# EAGLE design PIC 16F877A Board_V2 (EAGLE 9.6.2)
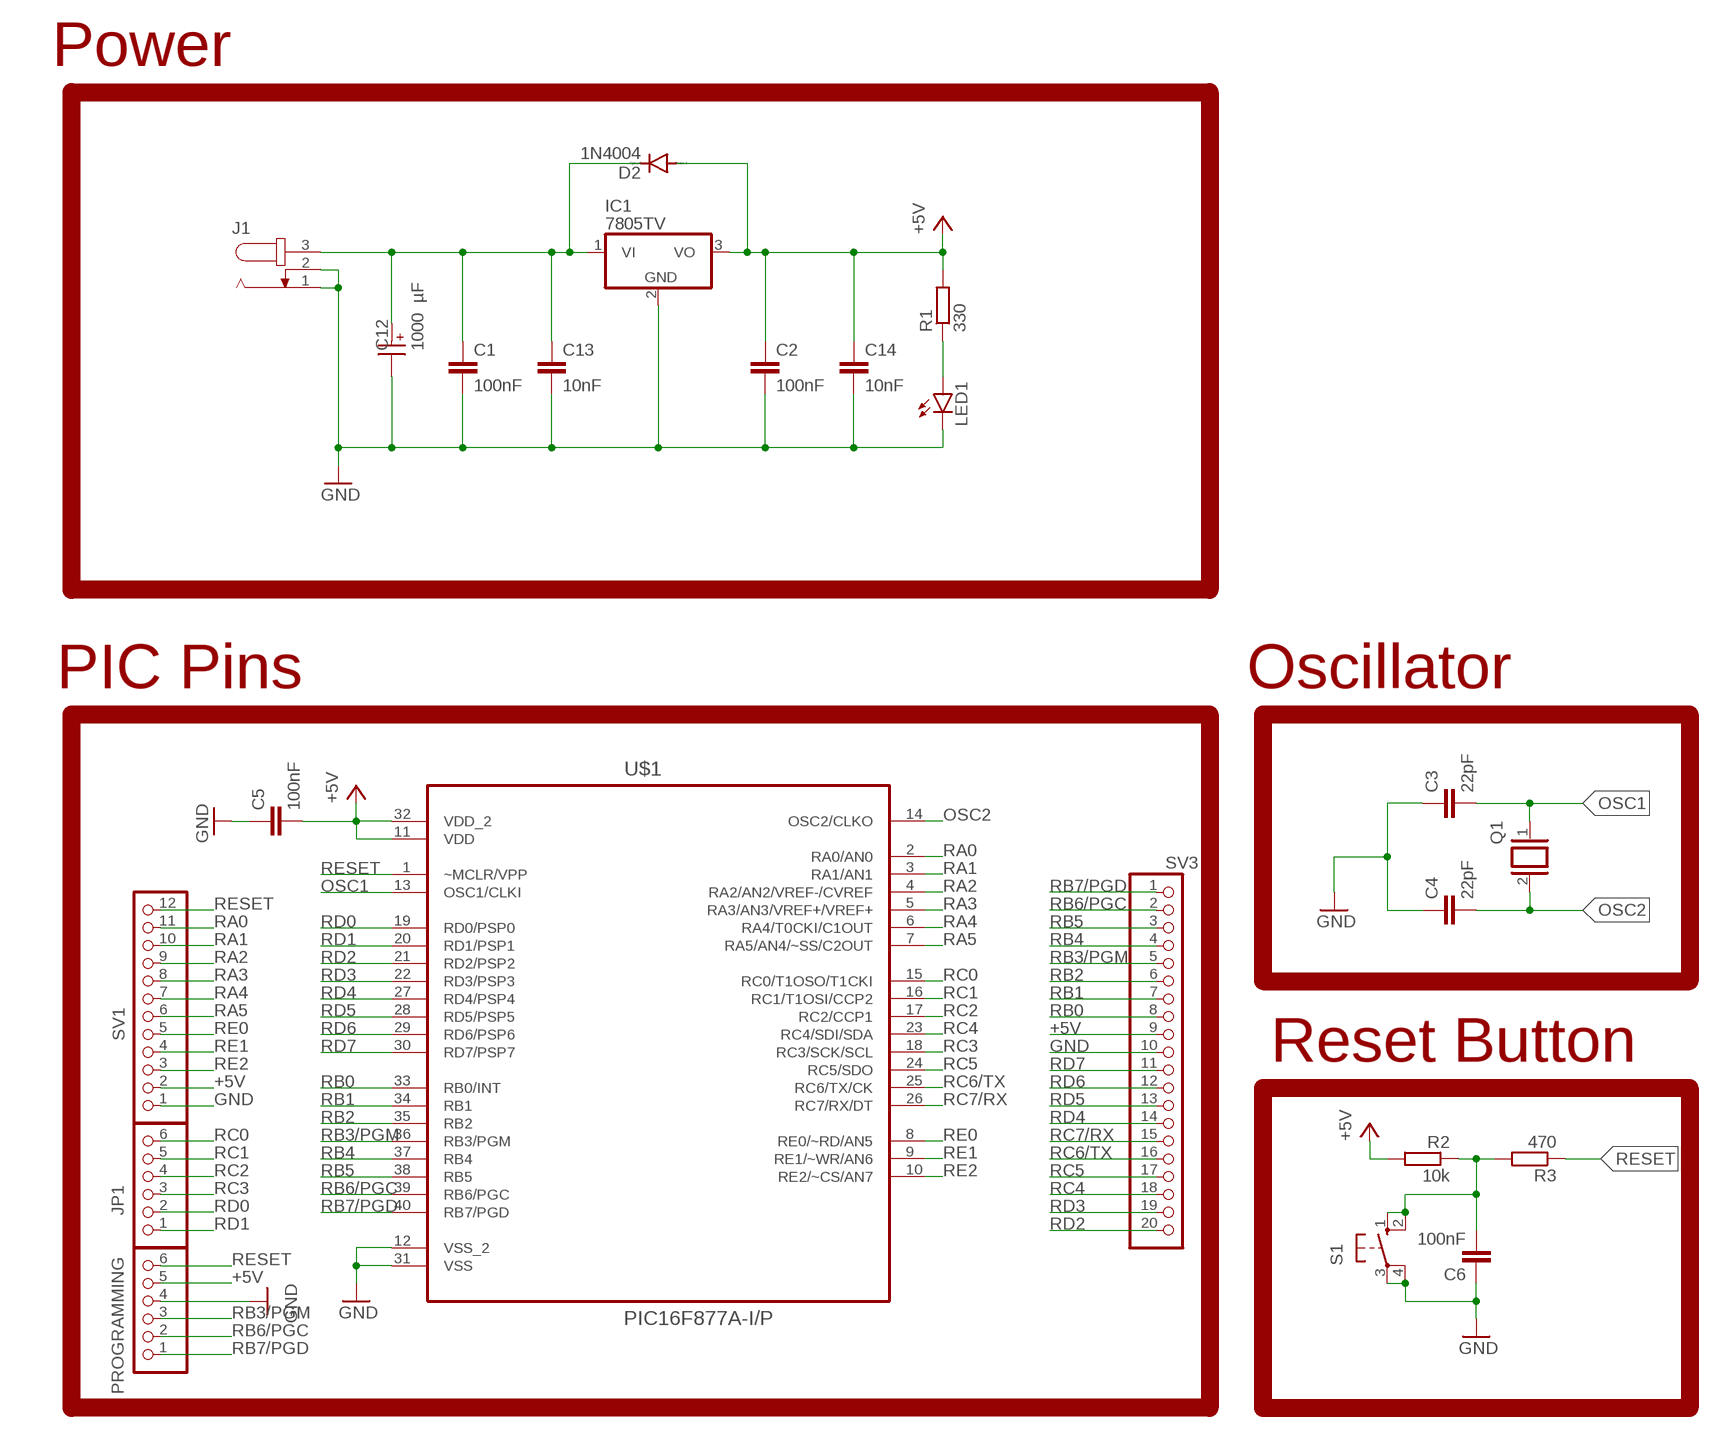
[diagram p0: schematic, sheet 1]

## Parts
C1  100nF  C-EU025-025X050  [C025-025X050]
C2  100nF  C-EU025-025X050  [C025-025X050]
C3  22pF  C-EU025-025X050  [C025-025X050]
C4  22pF  C-EU025-025X050  [C025-025X050]
C5  100nF  C-EU025-025X050  [C025-025X050]
C6  100nF  C-EU025-025X050  [C025-025X050]
C12  1000 µF  WCAP-ATG8_10X12.5_860010275016  [WCAP-ATG8_10X12.5(DXL)]
C13  10nF  C-EU025-025X050  [C025-025X050]
C14  10nF  C-EU025-025X050  [C025-025X050]
D2  1N4004  [DO41-10]
IC1  7805TV  [TO220V]
J1  JACK-PLUG0  [SPC4077]
JP1  PINHD-1X6  [1X06]
LED1  LED3MM  [LED3MM]
PROGRAMMING  PINHD-1X6  [1X06]
Q1  XTAL/S  [QS]
R1  330  R-EU_0204/7  [0204/7]
R2  10k  R-EU_0204/7  [0204/7]
R3  470  R-EU_0204/7  [0204/7]
S1  10-XX  [B3F-10XX]
SV1  PINHD-1X12  [1X12]
SV3  PINHD-1X20  [1X20]
U$1  PIC16F877A-I/P  [16F877A]

## Nets
+5V: C2.1 C5.2 C14.1 D2.A IC1.3(VO) PROGRAMMING.5 R1.2 R2.2 SV1.2 SV3.9 U$1.11(VDD) U$1.32(VDD_2)
GND: C1.2 C2.2 C3.1 C4.1 C5.1 C6.1 C12.2(-) C13.2 C14.2 IC1.2(GND) J1.1 J1.2 LED1.K(C) PROGRAMMING.4 S1.3(P) S1.4(P1) SV1.1 SV3.10 U$1.12(VSS_2) U$1.31(VSS)
N$1: C1.1 C12.1(+) C13.1 D2.C IC1.1(VI) J1.3
N$2: C6.2 R2.1 R3.2 S1.1(S) S1.2(S1)
N$4: LED1.A R1.1
OSC1: C3.2 Q1.1 U$1.13(OSC1/CLKI)
OSC2: C4.2 Q1.2 U$1.14(OSC2/CLKO)
RA0: SV1.11 U$1.2(RA0/AN0)
RA1: SV1.10 U$1.3(RA1/AN1)
RA2: SV1.9 U$1.4(RA2/AN2/VREF-/CVREF)
RA3: SV1.8 U$1.5(RA3/AN3/VREF+/VREF+)
RA4: SV1.7 U$1.6(RA4/T0CKI/C1OUT)
RA5: SV1.6 U$1.7(RA5/AN4/~SS/C2OUT)
RB0: SV3.8 U$1.33(RB0/INT)
RB1: SV3.7 U$1.34(RB1)
RB2: SV3.6 U$1.35(RB2)
RB3/PGM: PROGRAMMING.3 SV3.5 U$1.36(RB3/PGM)
RB4: SV3.4 U$1.37(RB4)
RB5: SV3.3 U$1.38(RB5)
RB6/PGC: PROGRAMMING.2 SV3.2 U$1.39(RB6/PGC)
RB7/PGD: PROGRAMMING.1 SV3.1 U$1.40(RB7/PGD)
RC0: JP1.6 U$1.15(RC0/T1OSO/T1CKI)
RC1: JP1.5 U$1.16(RC1/T1OSI/CCP2)
RC2: JP1.4 U$1.17(RC2/CCP1)
RC3: JP1.3 U$1.18(RC3/SCK/SCL)
RC4: SV3.18 U$1.23(RC4/SDI/SDA)
RC5: SV3.17 U$1.24(RC5/SDO)
RC6/TX: SV3.16 U$1.25(RC6/TX/CK)
RC7/RX: SV3.15 U$1.26(RC7/RX/DT)
RD0: JP1.2 U$1.19(RD0/PSP0)
RD1: JP1.1 U$1.20(RD1/PSP1)
RD2: SV3.20 U$1.21(RD2/PSP2)
RD3: SV3.19 U$1.22(RD3/PSP3)
RD4: SV3.14 U$1.27(RD4/PSP4)
RD5: SV3.13 U$1.28(RD5/PSP5)
RD6: SV3.12 U$1.29(RD6/PSP6)
RD7: SV3.11 U$1.30(RD7/PSP7)
RE0: SV1.5 U$1.8(RE0/~RD/AN5)
RE1: SV1.4 U$1.9(RE1/~WR/AN6)
RE2: SV1.3 U$1.10(RE2/~CS/AN7)
RESET: PROGRAMMING.6 R3.1 SV1.12 U$1.1(~MCLR/VPP)

## Notes on the sheet
- Power
- PIC Pins | Oscillator
- Reset Button

## Library data of the parts
C1-C6 C13 C14 = rcl:C-EU: CAPACITOR, European symbol; SPICEPREFIX: C
C12 = Aluminium Electrolyt Capacitors:WCAP-ATG8_10X12.5: WCAP-ATG8 Aluminium Electrolytic Capacitors General Purpose +85 °C Characteristics General purpose product series with max. operating temperature of +85 °C Wide range of capacitance value Mounting style: THT Radial Capacitance range: 0.1 µF ‒ 33000 µF Capacitance tolerance: ±20 % Voltage range (UR): 10 ‒ 400 V(DC) Operating temperature: -40 °C up to +85 °C for UR < 400 V(DC) -25 °C up to +85 °C for UR ≥ 400 V(DC) Endurance: 2000 h @ +85 °C Dimensions (DxL) in mm: 5.0 x 11.0 up to 22.0 x 51.0 Recommended soldering: Wave soldering Applications Filtering Smoothing Energy storage Coupling <https://www.we-online.com/catalog/media/o35732v209%20WCAP-ATG8_4C.jpg> Details see: https://www.we-online.com/catalog/en/WCAP-ATG8/ Updated by yingchun,Shan;2020-02-27 2020(C) Würth Elektronik; DATASHEET-URL: https://www.we-online.com/catalog/datasheet/860010275016.pdf; DF: 19%; DIAMETER: 10mm; I-LEAK: 100uA; I-RIPPLE: 726mA; L: 12.5mm; OPERATING-TEMPERATURE: -40 °C up to +85 °C; PART-NUMBER: 860010275016; PITCH: 5mm; TECHNICAL-REFERENCE: ATBF125102M010DSPA9B000; VR: 10V(DC)
D2 = diode:1N4004: DIODE general purpose rectifier, 1 A
IC1 = linear:78*: Positive VOLTAGE REGULATOR Source: http://cache.national.com/ds/LM/LM78L05.pdf http://www.fairchildsemi.com/ds/LM/LM7805.pdf
J1 = con-jack:JACK-PLUG: DC POWER JACK Power Jack, DC, Right Angle, Through Hole, Rated 5A at 16VDC, PC Terminals Distributor: Farnell (www.Farnell.de) Drawing: 84N1161.pdf / 84N1162.pdf Manufacturer: SPC Technology (www.spctechnology.com) Type: SPC4077 / SPC 4078; OC_FARNELL: unknown; OC_NEWARK: unknown
JP1 PROGRAMMING = pinhead:PINHD-1X6: PIN HEADER
LED1 = led:LED: LED OSRAM: - CHIPLED LG R971, LG N971, LY N971, LG Q971, LY Q971, LO R971, LY R971 LH N974, LH R974 LS Q976, LO Q976, LY Q976 LO Q996 - Hyper CHIPLED LW Q18S LB Q993, LB Q99A, LB R99A - SideLED LS A670, LO A670, LY A670, LG A670, LP A670 LB A673, LV A673, LT A673, LW A673 LH A674 LY A675 LS A676, LA A676, LO A676, LY A676, LW A676 LS A679, LY A679, LG A679 - Hyper Micro SIDELED® LS Y876, LA Y876, LO Y876, LY Y876 LT Y87S - SmartLED LW L88C, LW L88S LB L89C, LB L89S, LG L890 LS L89K, LO L89K, LY L89K LS L896, LA L896, LO L896, LY L896 - TOPLED LS T670, LO T670, LY T670, LG T670, LP T670 LSG T670, LSP T670, LSY T670, LOP T670, LYG T670 LG T671, LOG T671, LSG T671 LB T673, LV T673, LT T673, LW T673 LH T674 LS T676, LA T676, LO T676, LY T676, LB T676, LH T676, LSB T676, LW T676 LB T67C, LV T67C, LT T67C, LS T67K, LO T67K, LY T67K, LW E67C LS E67B, LA E67B, LO E67B, LY E67B, LB E67C, LV E67C, LT E67C LW T67C LS T679, LY T679, LG T679 LS T770, LO T770, LY T770, LG T770, LP T770 LB T773, LV T773, LT T773, LW T773 LH T774 LS E675, LA E675, LY E675, LS T675 LS T776, LA T776, LO T776, LY T776, LB T776 LHGB T686 LT T68C, LB T68C - Hyper Mini TOPLED® LB M676 - Mini TOPLED Santana® LG M470 LS M47K, LO M47K, LY M47K Source: http://www.osram.convergy.de LUXEON: - LUMILED® LXK2-PW12-R00, LXK2-PW12-S00, LXK2-PW14-U00, LXK2-PW14-V00 LXK2-PM12-R00, LXK2-PM12-S00, LXK2-PM14-U00 LXK2-PE12-Q00, LXK2-PE12-R00, LXK2-PE12-S00, LXK2-PE14-T00, LXK2-PE14-U00 LXK2-PB12-K00, LXK2-PB12-L00, LXK2-PB12-M00, LXK2-PB14-N00, LXK2-PB14-P00, LXK2-PB14-Q00 LXK2-PR12-L00, LXK2-PR12-M00, LXK2-PR14-Q00, LXK2-PR14-R00 LXK2-PD12-Q00, LXK2-PD12-R00, LXK2-PD12-S00 LXK2-PH12-R00, LXK2-PH12-S00 LXK2-PL12-P00, LXK2-PL12-Q00, LXK2-PL12-R00 Source: www.luxeon.com KINGBRIGHT: KA-3528ASYC Source: www.kingbright.com
Q1 = special:XTAL/S: CRYSTAL
R1-R3 = rcl:R-EU_: RESISTOR, European symbol; SPICEPREFIX: R
S1 = switch-omron:10-XX: OMRON SWITCH; MPN: B3F-1000; OC_FARNELL: 176432; OC_NEWARK: 36M3542
SV1 = pinhead:PINHD-1X12: PIN HEADER
SV3 = pinhead:PINHD-1X20: PIN HEADER
U$1 = PIC - 16F877A:PIC16F877A-I/P: 8-Bit CMOS FLASH Microcontrollers Check prices <https://pricing.snapeda.com/parts/PIC16F877A-I/P/Microchip/view-part?ref=eda>; AVAILABILITY: Good; DESCRIPTION: PIC PIC® 16F Microcontroller IC 8-Bit 20MHz 14KB (8K x 14) FLASH 44-TQFP (10x10); MF: Microchip; MP: PIC16F877A-I/P; PACKAGE: DIP-40 Microchip; PRICE: None; PURCHASE-URL: https://pricing.snapeda.com/search/part/PIC16F877A-I/P/?ref=eda

## Board
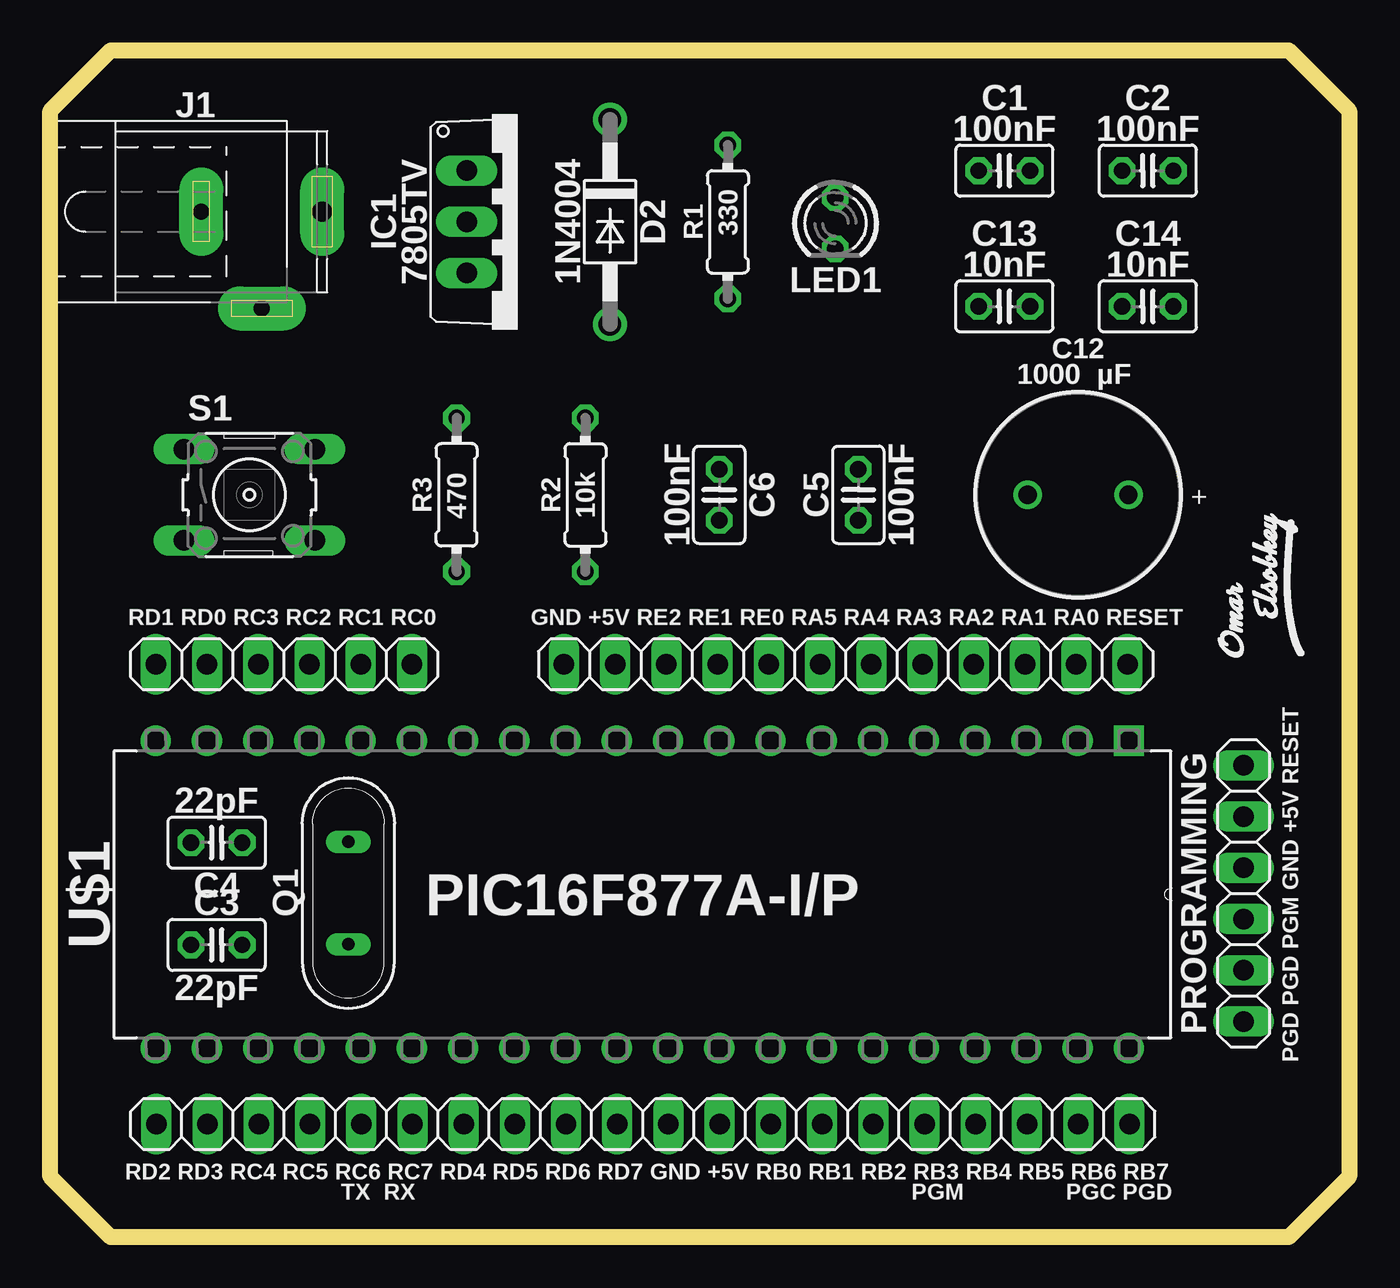
[diagram p1: board, top side]
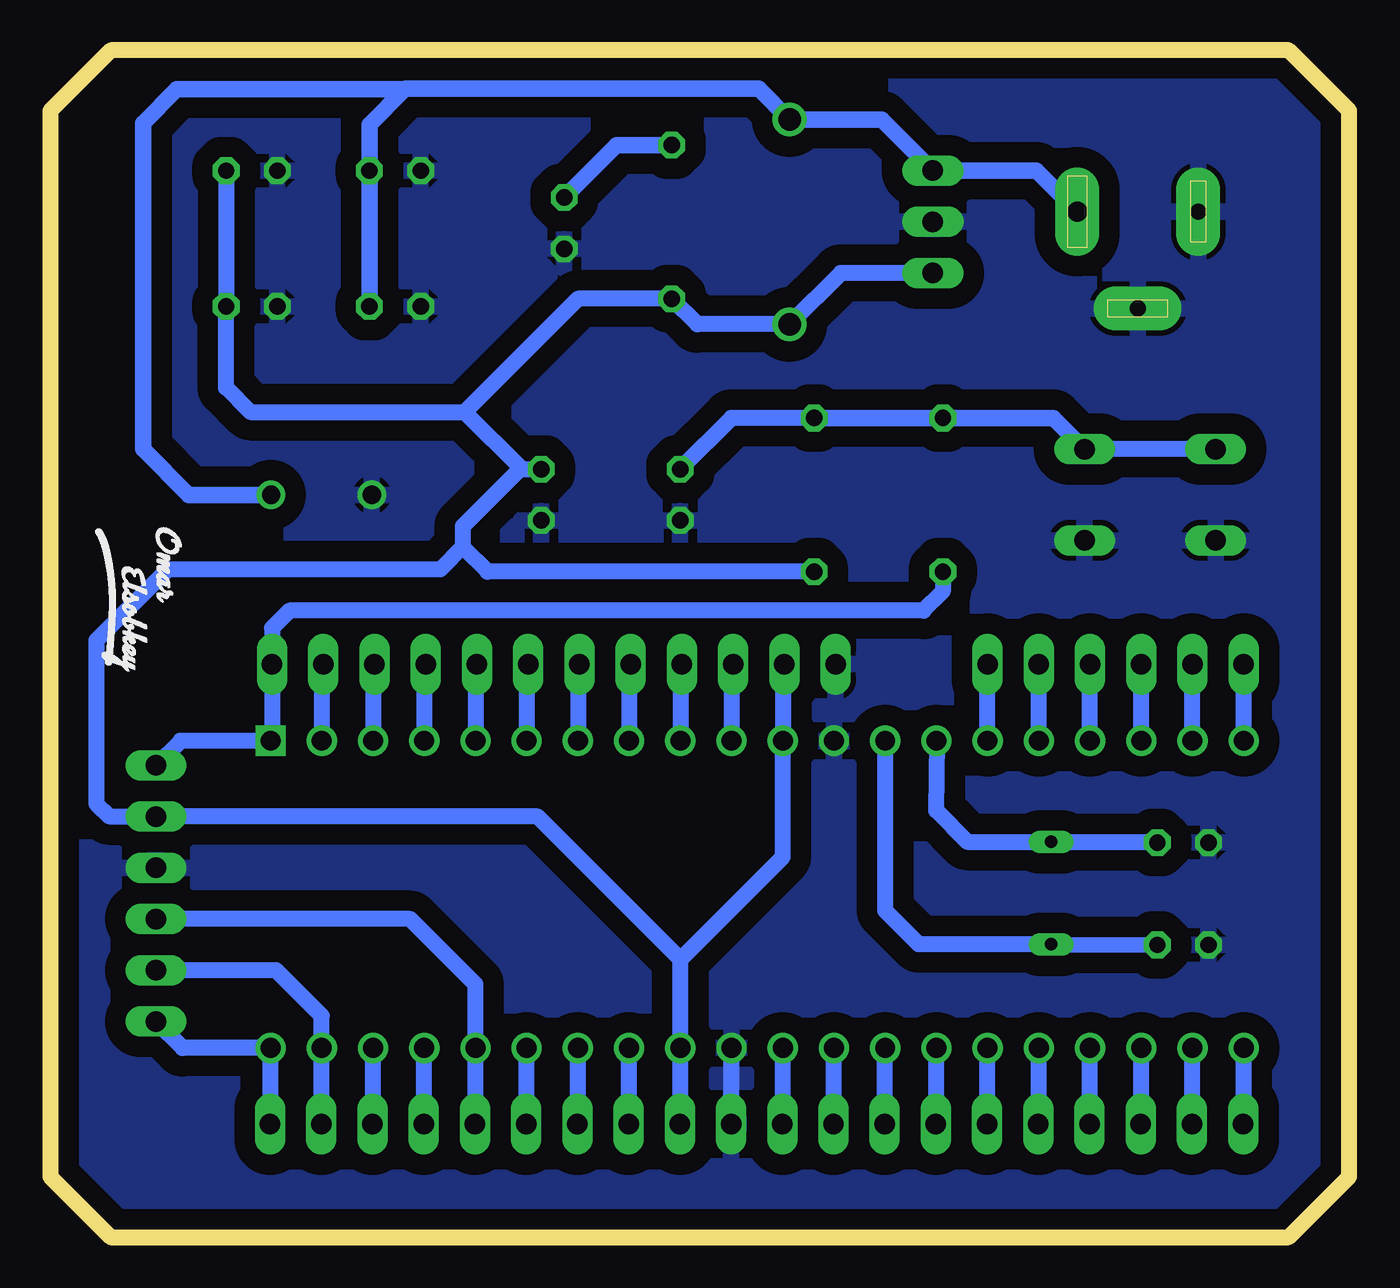
[diagram p2: board, bottom side, seen from below]

Size 64.41 x 58.86 mm. Coordinates in mm from the lower left corner, seen from the top.
Outline: 64.41,55.86 64.41,3 61.41,0 3,0 0,3 0,55.86 3,58.86 61.41,58.86 64.41,55.86
Copper layers (1*16): Top 0.035mm / dielectric 1.5mm / Bottom 0.035mm
Design rules "default *": minimum track width 0.8mm, minimum drill 0.6mm, track to track 0.6mm, track to pad 0.6mm, pad to pad 0.6mm, via to via 0.6mm, smd to smd 0.6mm, copper to edge 40mil, drill to drill 6mil, minimum pad ring 10mil, minimum via ring 8mil, stop-mask expansion 4mil, vias tented up to drill 0mil, thermal gap 10mil

### Footprints (pad centres in the part's own frame; a part is rotated, then mirrored left to right if it is on the bottom)
C025-025X050 = drill 0.813 octagon: 1 -1.27,0; 2 1.27,0
WCAP-ATG8_10X12.5(DXL) = drill 0.9: 1 2.5,0; 2 -2.5,0
DO41-10 = drill 1.118: A 5.08,0; C -5.08,0
TO220V = drill 1.016 long: 1 -2.54,-2.54; 2 0,-2.54; 3 2.54,-2.54
SPC4077 = drill 0.8 pad 2.184 long: 1 -3,0; 2 0,-4.8 | drill 1 pad 2.184 long: 3 3,0
1X06 = drill 1.016 long: 1 -6.35,0; 2 -3.81,0; 3 -1.27,0; 4 1.27,0; 5 3.81,0; 6 6.35,0
LED3MM = drill 0.813 octagon: A -1.27,0; K 1.27,0
QS = drill 0.61 long: 1 -2.54,0; 2 2.54,0
0204/7 = drill 0.813 octagon: 1 -3.81,0; 2 3.81,0
B3F-10XX = drill 1.016 long: 1 -3.251,2.261; 2 3.251,2.261; 3 -3.251,-2.261; 4 3.251,-2.261
1X12 = drill 1.016 long: 1 -13.97,0; 2 -11.43,0; 3 -8.89,0; 4 -6.35,0; 5 -3.81,0; 6 -1.27,0; 7 1.27,0; 8 3.81,0; 9 6.35,0; 10 8.89,0; 11 11.43,0; 12 13.97,0
1X20 = drill 1.016 long: 1 -24.13,0; 2 -21.59,0; 3 -19.05,0; 4 -16.51,0; 5 -13.97,0; 6 -11.43,0; 7 -8.89,0; 8 -6.35,0; 9 -3.81,0; 10 -1.27,0; 11 1.27,0; 12 3.81,0; 13 6.35,0; 14 8.89,0; 15 11.43,0; 16 13.97,0; 17 16.51,0; 18 19.05,0; 19 21.59,0; 20 24.13,0
16F877A = drill 0.991 square: 1 -15.24,48.26 | drill 0.991: 2 -15.24,45.72; 3 -15.24,43.18; 4 -15.24,40.64; 5 -15.24,38.1; 6 -15.24,35.56; 7 -15.24,33.02; 8 -15.24,30.48; 9 -15.24,27.94; 10 -15.24,25.4; 11 -15.24,22.86; 12 -15.24,20.32; 13 -15.24,17.78; 14 -15.24,15.24; 15 -15.24,12.7; 16 -15.24,10.16; 17 -15.24,7.62; 18 -15.24,5.08; 19 -15.24,2.54; 20 -15.24,0; 21 0,0; 22 0,2.54; 23 0,5.08; 24 0,7.62; 25 0,10.16; 26 0,12.7; 27 0,15.24; 28 0,17.78; 29 0,20.32; 30 0,22.86; 31 0,25.4; 32 0,27.94; 33 0,30.48; 34 0,33.02; 35 0,35.56; 36 0,38.1; 37 0,40.64; 38 0,43.18; 39 0,45.72; 40 0,48.26

### Placement (x,y rotation side)
C1  47.31,52.9 180 top
C2  54.42,52.9 180 top
C3  8.24,14.5 0 top
C4  8.24,19.57 0 top
C5  40.07,36.82 90 top
C6  33.17,36.82 90 top
C12  50.97,36.82 0 top
C13  47.31,46.17 180 top
C14  54.42,46.17 180 top
D2  27.75,50.36 270 top
IC1  23.18,50.36 270 top
J1  10.48,50.87 0 top
JP1  11.58,28.42 0 top
LED1  38.93,50.29 270 top
PROGRAMMING  59.18,17.06 90 top
Q1  14.77,17.08 90 top
R1  33.59,50.36 270 top
R2  26.53,36.82 270 top
R3  20.14,36.82 90 top
S1  9.87,36.82 0 top
SV1  39.44,28.42 0 top
SV3  29.38,5.61 180 top
U$1  5.23,9.39 270 top
U$2  [OMAR_ELSOBKEY_X0.5_TN]  60.24,31.98 90 top
U$4  [OMAR_ELSOBKEY_X0.5_TN]  60.24,31.98 270 bottom

### Tracks (layer width: path | path; a pad name or v marks a point on that pad's centre or on a via)
+5V
  Bottom 0.8: IC1.3 25.21,47.82 D2.A 32.32,45.28 R1.2 38.24,46.55 43.86,40.93 | C2.1 C14.1 55.69,42.13 54.49,40.93 43.86,40.93 | SV1.2 28.01,27.76 28.09,27.69 U$1.11 28.09,18.87 33.17,13.79 | SV3.9 33.19,6.27 33.17,6.3 U$1.32 33.17,13.79 | 33.17,13.79 40.24,20.87 PROGRAMMING.5 61.5,20.88 62.12,21.5 62.12,29.6 58.6,33.12 45.06,33.12 43.96,34.23 | 43.86,40.93 41.02,38.09 | 41.02,38.09 41.12,38.09 43.96,35.25 43.96,34.23 | 41.02,38.09 C5.2 | 43.96,34.23 42.74,33.01 R2.2
GND
  Bottom 0.8: U$1.31 30.63,6.3 30.65,6.27 SV3.10
  pour Bottom (isolate 1.016): -3.94,62.39 68.67,62.39 68.67,-4.35 68.49,-4.35 -3.94,-4.35
N$1
  Bottom 0.813: J1.3 15.51,52.9 IC1.1 23.18,55.44 D2.C 29.27,56.95 46.81,56.95 46.84,56.93 | 46.84,56.93 48.58,55.18 C1.1 C13.1 | 46.84,56.93 58.14,56.93 59.81,55.26 59.81,39.08 57.55,36.82 C12.1
N$2
  Bottom 0.8: R2.1 30.63,40.63 C6.2 | S1.1 S1.2
  Bottom 0.813: S1.2 14.67,40.63 R3.2 R2.1
N$4
  Bottom 0.813: R1.1 36.33,54.17 LED1.A
OSC1
  Bottom 0.8: U$1.13 23.03,24.65 | 23.06,24.68 U$1.13 | U$1.13 23.01,16.2 21.34,14.54 Q1.1 C3.2
OSC2
  Bottom 0.8: 20.49,24.65 U$1.14 20.43,24.59 20.47,21.16 18.93,19.62 Q1.2 9.59,19.62 C4.2
RA0
  Bottom 0.8: U$1.2 50.95,27.69 50.87,27.76 SV1.11
RA1
  Bottom 0.8: U$1.3 48.41,27.69 48.33,27.76 SV1.10
RA2
  Bottom 0.8: U$1.4 45.87,27.69 45.79,27.76 SV1.9
RA3
  Bottom 0.8: U$1.5 43.33,27.69 43.25,27.76 SV1.8
RA4
  Bottom 0.8: U$1.6 40.79,27.69 40.71,27.76 SV1.7
RA5
  Bottom 0.8: U$1.7 38.25,27.69 38.17,27.76 SV1.6
RB0
  Bottom 0.8: U$1.33 35.71,6.3 35.73,6.27 SV3.8
RB1
  Bottom 0.8: U$1.34 38.25,6.3 38.27,6.27 SV3.7
RB2
  Bottom 0.8: U$1.35 40.79,6.3 40.81,6.27 SV3.6
RB3/PGM
  Bottom 0.8: SV3.5 43.35,6.27 43.33,6.3 U$1.36 43.33,12.55 46.57,15.79 PROGRAMMING.3
RB4
  Bottom 0.8: U$1.37 45.87,6.3 45.89,6.27 SV3.4
RB5
  Bottom 0.8: U$1.38 48.41,6.3 48.43,6.27 SV3.3
RB6/PGC
  Bottom 0.8: SV3.2 50.97,6.27 50.95,6.3 U$1.39 50.95,10.97 53.22,13.25 PROGRAMMING.2
RB7/PGD
  Bottom 0.8: SV3.1 53.51,6.27 53.49,6.3 U$1.40 57.86,9.38 PROGRAMMING.1
RC0
  Bottom 0.8: U$1.15 JP1.6
RC1
  Bottom 0.8: U$1.16 JP1.5
RC2
  Bottom 0.8: U$1.17 JP1.4
RC3
  Bottom 0.8: U$1.18 JP1.3
RC4
  Bottom 0.8: U$1.23 10.31,6.3 10.33,6.27 SV3.18
RC5
  Bottom 0.8: U$1.24 12.85,6.3 12.87,6.27 SV3.17
RC6/TX
  Bottom 0.8: U$1.25 15.39,6.3 15.41,6.27 SV3.16
RC7/RX
  Bottom 0.8: U$1.26 17.93,6.3 17.95,6.27 SV3.15
RD0
  Bottom 0.8: U$1.19 JP1.2
RD1
  Bottom 0.8: U$1.20 JP1.1
RD2
  Bottom 0.8: U$1.21 5.23,6.3 5.25,6.27 SV3.20
RD3
  Bottom 0.8: U$1.22 7.77,6.3 7.79,6.27 SV3.19
RD4
  Bottom 0.8: U$1.27 20.47,6.3 20.49,6.27 SV3.14
RD5
  Bottom 0.8: U$1.28 23.01,6.3 23.03,6.27 SV3.13
RD6
  Bottom 0.8: U$1.29 25.55,6.3 25.57,6.27 SV3.12
RD7
  Bottom 0.8: U$1.30 28.09,6.3 28.11,6.27 SV3.11
RE0
  Bottom 0.8: U$1.8 35.71,27.69 35.63,27.76 SV1.5
RE1
  Bottom 0.8: U$1.9 33.17,27.69 33.09,27.76 SV1.4
RE2
  Bottom 0.8: U$1.10 30.63,27.69 30.55,27.76 SV1.3
RESET
  Bottom 0.8: SV1.12 53.41,24.7 U$1.1 57.96,24.62 PROGRAMMING.6 | SV1.12 | SV1.12 53.41,30.21 52.55,31.07 21.1,31.07 20.14,32.03 R3.1

### Text on the board
tNames: RD1 RD0 RC3 RC2 RC1 RC0 | GND +5V RE2 RE1 RE0 RA5 RA4 RA3 RA2 RA1 RA0 RESET | PGD PGD PGM GND +5V RESET | RD2 RD3 RC4 RC5 RC6 RC7 RD4 RD5 RD6 RD7 GND +5V RB0 RB1 RB2 RB3 RB4 RB5 RB6 RB7 | TX RX | PGM | PGC PGD